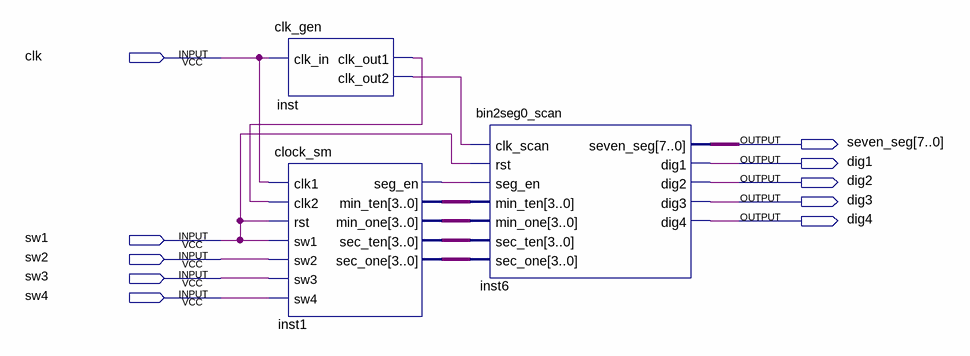
[diagram p0: schematic sheet]
// Quartus schematic clock.bdf as structural Verilog: 3 symbols, 10 pins
module clock (
  input  clk,
  input  sw1,
  input  sw2,
  input  sw3,
  input  sw4,
  output [7:0] seven_seg,
  output dig1,
  output dig2,
  output dig3,
  output dig4
);

  wire inst1_seg_en, inst_clk_out1, inst_clk_out2;
  wire [3:0] inst1_min_one, inst1_min_ten, inst1_sec_one, inst1_sec_ten;

  clk_gen inst (.clk_in(clk), .clk_out1(inst_clk_out1), .clk_out2(inst_clk_out2));
  clock_sm inst1 (
    .clk1(clk), .clk2(inst_clk_out1), .rst(sw1), .sw1(sw1), .sw2(sw2), .sw3(sw3), .sw4(sw4),
    .seg_en(inst1_seg_en), .min_ten(inst1_min_ten), .min_one(inst1_min_one), .sec_ten(inst1_sec_ten),
    .sec_one(inst1_sec_one));
  bin2seg0_scan inst6 (
    .clk_scan(inst_clk_out2), .rst(sw1), .seg_en(inst1_seg_en), .min_ten(inst1_min_ten),
    .min_one(inst1_min_one), .sec_ten(inst1_sec_ten), .sec_one(inst1_sec_one), .seven_seg(seven_seg),
    .dig1(dig1), .dig2(dig2), .dig3(dig3), .dig4(dig4));
endmodule
